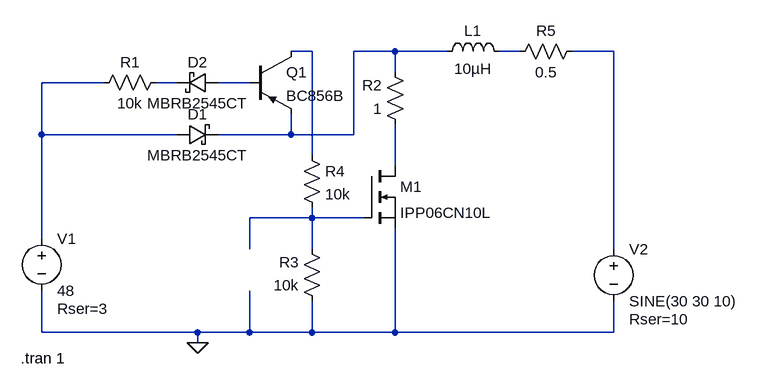
[diagram p0: schematic BreakResistor.asc]
BreakResistor.asc, the LTspice schematic file:
Version 4
SHEET 1 880 680
WIRE -16 -64 -48 -64
WIRE 112 -64 48 -64
WIRE 192 -64 112 -64
WIRE 304 -64 272 -64
WIRE 448 -64 384 -64
WIRE 112 -32 112 -64
WIRE -336 -16 -432 -16
WIRE -224 -16 -256 -16
WIRE -112 -16 -160 -16
WIRE -432 64 -432 -16
WIRE -224 64 -432 64
WIRE -48 64 -48 32
WIRE -48 64 -160 64
WIRE 48 64 48 -64
WIRE 48 64 -48 64
WIRE -16 96 -16 -64
WIRE 112 112 112 48
WIRE -16 192 -16 176
WIRE -16 192 -112 192
WIRE 64 192 -16 192
WIRE -432 224 -432 64
WIRE -112 240 -112 192
WIRE -16 240 -16 192
WIRE 448 240 448 -64
WIRE -432 368 -432 304
WIRE -192 368 -432 368
WIRE -112 368 -112 304
WIRE -112 368 -192 368
WIRE -16 368 -16 320
WIRE -16 368 -112 368
WIRE 112 368 112 208
WIRE 112 368 -16 368
WIRE 448 368 448 320
WIRE 448 368 112 368
WIRE -192 384 -192 368
FLAG -192 384 0
SYMBOL nmos 64 112 R0
SYMATTR InstName M1
SYMATTR Value IPP06CN10L
SYMBOL pnp -112 -64 R0
SYMATTR InstName Q1
SYMATTR Value BC856B
SYMBOL schottky -224 80 R270
WINDOW 0 32 32 VTop 2
WINDOW 3 0 32 VBottom 2
SYMATTR InstName D1
SYMATTR Value MBRB2545CT
SYMATTR Description Diode
SYMATTR Type diode
SYMBOL schottky -160 -32 R90
WINDOW 0 0 32 VBottom 2
WINDOW 3 32 32 VTop 2
SYMATTR InstName D2
SYMATTR Value MBRB2545CT
SYMATTR Description Diode
SYMATTR Type diode
SYMBOL voltage -432 208 R0
WINDOW 123 0 0 Left 2
WINDOW 39 24 124 Left 2
SYMATTR SpiceLine Rser=3
SYMATTR InstName V1
SYMATTR Value 48
SYMBOL voltage 448 224 R0
WINDOW 123 0 0 Left 2
WINDOW 39 24 124 Left 2
SYMATTR SpiceLine Rser=10
SYMATTR InstName V2
SYMATTR Value SINE(30 30 10)
SYMBOL res -240 -32 R90
WINDOW 0 0 56 VBottom 2
WINDOW 3 32 56 VTop 2
SYMATTR InstName R1
SYMATTR Value 10k
SYMBOL res 128 64 R180
WINDOW 0 36 76 Left 2
WINDOW 3 36 40 Left 2
SYMATTR InstName R2
SYMATTR Value 1
SYMBOL res 0 336 R180
WINDOW 0 36 76 Left 2
WINDOW 3 36 40 Left 2
SYMATTR InstName R3
SYMATTR Value 10k
SYMBOL res -32 80 R0
SYMATTR InstName R4
SYMATTR Value 10k
SYMBOL ind 176 -48 R270
WINDOW 0 32 56 VTop 2
WINDOW 3 5 56 VBottom 2
SYMATTR InstName L1
SYMATTR Value 10µH
SYMBOL res 400 -80 R90
WINDOW 0 0 56 VBottom 2
WINDOW 3 32 56 VTop 2
SYMATTR InstName R5
SYMATTR Value 0.5
TEXT -464 408 Left 2 !.tran 1

The netlist it stands for:
* BreakResistor.asc
M1 N008 N009 0 0 IPP06CN10L
Q1 N001 N007 N002 0 BC856B
D1 N005 N002 MBRB2545CT
D2 N007 N006 MBRB2545CT
V1 N005 0 48 Rser=3
V2 N004 0 SINE(30 30 10) Rser=10
R1 N006 N005 10k
R2 N008 N002 1
R3 0 N009 10k
R4 N001 N009 10k
L1 N002 N003 10µH
R5 N004 N003 0.5
.model D D
.lib standard.dio
.model NPN NPN
.model PNP PNP
.lib standard.bjt
.model NMOS NMOS
.model PMOS PMOS
.lib standard.mos
.tran 1
.backanno
.end